# Altium schematic sheet Top.SchDoc: Top
size 431 x 279 mm; Author: Alberto Marrone, Christian Schmitz, Leo Walter; DrawnBy: Alberto Marrone, Christian Schmitz, Leo Walter; Engineer: Alberto Marrone, Christian Schmitz, Leo Walter; Revision: V1.0; SheetNumber: 1; Project: PCB Design Final Project
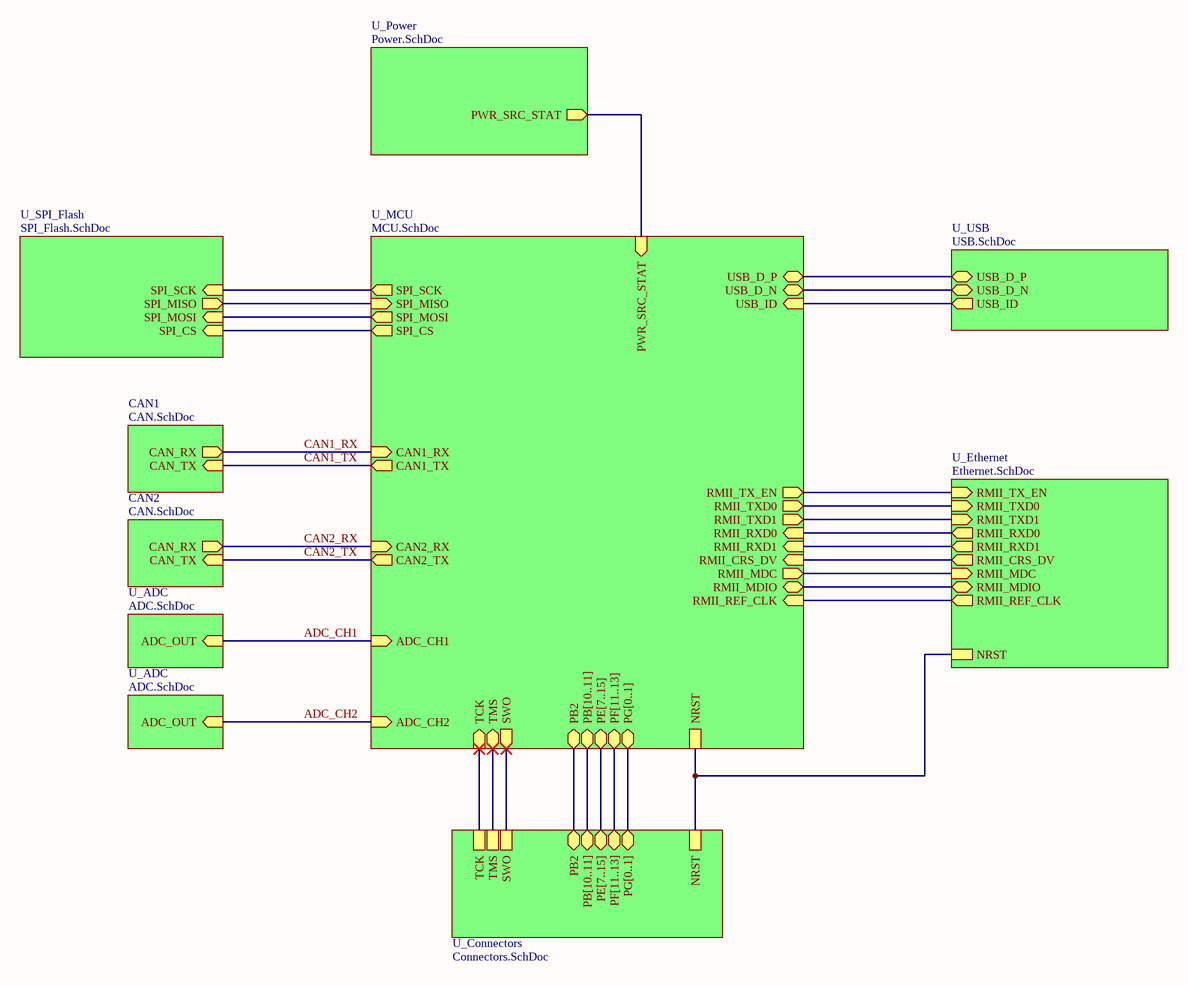
[diagram p0: Top.SchDoc]

## Sub-sheets
CAN1 = CAN.SchDoc: CAN_TX (in), CAN_RX (out)
CAN2 = CAN.SchDoc: CAN_TX (in), CAN_RX (out)
U_ADC = ADC.SchDoc: ADC_OUT (in)
U_ADC = ADC.SchDoc: ADC_OUT (in)
U_Connectors = Connectors.SchDoc: PF[11..13] (bidir), PB[10..11] (bidir), PE[7..15] (bidir), TCK, TMS, SWO, NRST, PB2 (bidir), PG[0..1] (bidir)
U_Ethernet = Ethernet.SchDoc: RMII_TXD0 (in), RMII_TX_EN (in), RMII_RXD0 (out), RMII_REF_CLK (out), RMII_CRS_DV (out), RMII_MDC (in), RMII_MDIO (bidir), NRST, RMII_TXD1 (in), RMII_RXD1 (out)
U_MCU = MCU.SchDoc: RMII_TXD0 (out), RMII_TX_EN (out), RMII_RXD0 (in), RMII_REF_CLK (in), RMII_CRS_DV (in), RMII_MDC (out), RMII_MDIO (bidir), RMII_TXD1 (out), RMII_RXD1 (in), SPI_SCK (out), SPI_MOSI (out), SPI_CS (out), SPI_MISO (in), USB_ID (in), PWR_SRC_STAT (in), CAN2_RX (in), CAN2_TX (out), SWO (out), TMS (bidir), TCK (in), NRST, USB_D_N (bidir), USB_D_P (bidir), CAN1_TX (out), CAN1_RX (in), ADC_CH1 (in), ADC_CH2 (in), PB2 (bidir), PB[10..11] (bidir), PF[11..13] (bidir), PE[7..15] (bidir), PG[0..1] (bidir)
U_Power = Power.SchDoc: PWR_SRC_STAT (out)
U_SPI_Flash = SPI_Flash.SchDoc: SPI_SCK (in), SPI_MOSI (in), SPI_MISO (out), SPI_CS (in)
U_USB = USB.SchDoc: USB_ID (out), USB_D_N (bidir), USB_D_P (bidir)

## Nets
ADC_CH1: sheet U_MCU/ADC_CH1, sheet U_ADC/ADC_OUT
ADC_CH2: sheet U_MCU/ADC_CH2, sheet U_ADC/ADC_OUT
CAN1_RX: sheet U_MCU/CAN1_RX, sheet CAN1/CAN_RX
CAN1_TX: sheet U_MCU/CAN1_TX, sheet CAN1/CAN_TX
CAN2_RX: sheet U_MCU/CAN2_RX, sheet CAN2/CAN_RX
CAN2_TX: sheet U_MCU/CAN2_TX, sheet CAN2/CAN_TX
(unnamed): sheet U_Connectors/TCK, sheet U_MCU/TCK
(unnamed): sheet U_Connectors/TMS, sheet U_MCU/TMS
(unnamed): sheet U_Connectors/SWO, sheet U_MCU/SWO
(unnamed): sheet U_Connectors/NRST, sheet U_Ethernet/NRST, sheet U_MCU/NRST
(unnamed): sheet U_Connectors/PB2, sheet U_MCU/PB2
(unnamed): sheet U_Ethernet/RMII_TXD0, sheet U_MCU/RMII_TXD0
(unnamed): sheet U_Ethernet/RMII_TX_EN, sheet U_MCU/RMII_TX_EN
(unnamed): sheet U_Ethernet/RMII_RXD0, sheet U_MCU/RMII_RXD0
(unnamed): sheet U_Ethernet/RMII_REF_CLK, sheet U_MCU/RMII_REF_CLK
(unnamed): sheet U_Ethernet/RMII_CRS_DV, sheet U_MCU/RMII_CRS_DV
(unnamed): sheet U_Ethernet/RMII_MDC, sheet U_MCU/RMII_MDC
(unnamed): sheet U_Ethernet/RMII_MDIO, sheet U_MCU/RMII_MDIO
(unnamed): sheet U_Ethernet/RMII_TXD1, sheet U_MCU/RMII_TXD1
(unnamed): sheet U_Ethernet/RMII_RXD1, sheet U_MCU/RMII_RXD1
(unnamed): sheet U_MCU/SPI_SCK, sheet U_SPI_Flash/SPI_SCK
(unnamed): sheet U_MCU/SPI_MOSI, sheet U_SPI_Flash/SPI_MOSI
(unnamed): sheet U_MCU/SPI_CS, sheet U_SPI_Flash/SPI_CS
(unnamed): sheet U_MCU/SPI_MISO, sheet U_SPI_Flash/SPI_MISO
(unnamed): sheet U_MCU/USB_ID, sheet U_USB/USB_ID
(unnamed): sheet U_MCU/PWR_SRC_STAT, sheet U_Power/PWR_SRC_STAT
(unnamed): sheet U_MCU/USB_D_N, sheet U_USB/USB_D_N
(unnamed): sheet U_MCU/USB_D_P, sheet U_USB/USB_D_P

## Buses and harness runs
bus sheet U_Connectors/PB[10..11] = sheet U_MCU/PB[10..11]
bus sheet U_Connectors/PE[7..15] = sheet U_MCU/PE[7..15]
bus sheet U_Connectors/PF[11..13] = sheet U_MCU/PF[11..13]
bus sheet U_Connectors/PG[0..1] = sheet U_MCU/PG[0..1]

## Notes on the sheet
- DWG. NO.
- REV.
- SHT.
- THIS DOCUMENT AND THE DATA DISCLOSED HEREIN OR HEREWITH IS THE PROPERTY OF ALTIUM LIMITED AND MAY BE FREELY DISTRIBUTED IN WHOLE. NO RIGHTS ARE RESERVED OR EXPRESS OR IMPLIED WARANTEE GIVEN.
- REVISION
- DESCRIPTION
- DATE
- APPROVED
- ENG:
- APPROVALS
- PROJECT
- DSN:
- CHK:
- REFERENCE DOCUMENTS
- PROJECT REVISION:
- TITLE
- DOCUMENT REVISION:
- DESIGN ITEM:
- BOM:
- FAB DWG:
- PCB DWG:
- ASSY DWG:
- SCALE:
- SIZE
- B
- CAGE CODE
- FILE NAME
- DWG NO.
- SHEET
- OF
- REV